# EAGLE design wDuino (EAGLE 6.6.0)
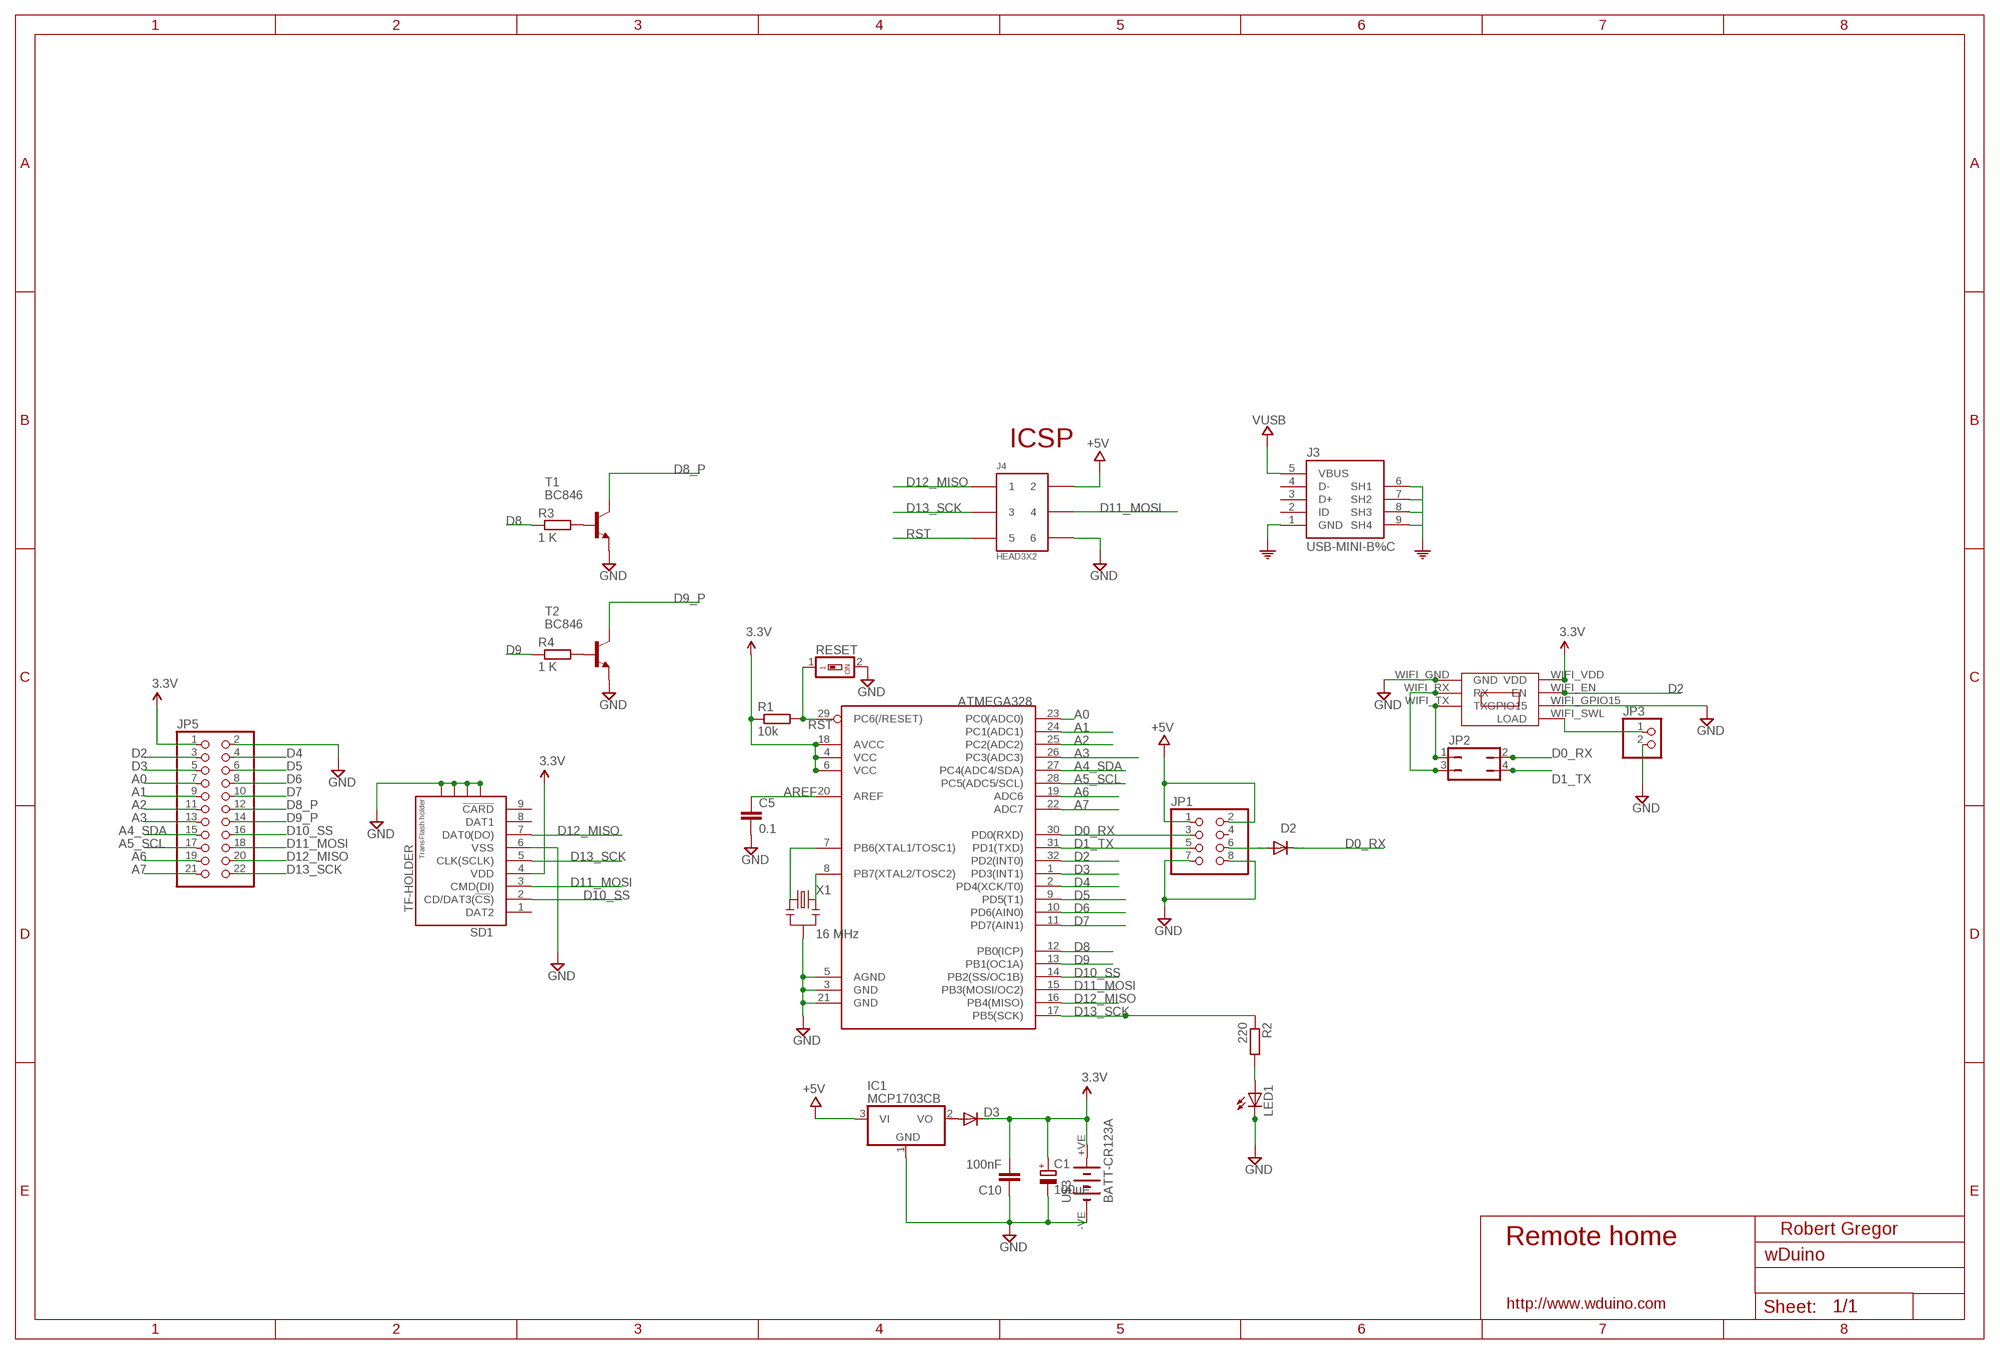
[diagram p0: schematic, sheet 1]

## Parts
ATMEGA328  ATMega-328  ATMEGA168/328TQFP32  [TQFP32-08]
C1  100uF  CPOL-EUSMCB  [SMC_B]
C5  0.1  C-EUC0603  [C0603]
C10  100nF  C-EUC0603  [C0603]
D2  DIODE-SOD123  [SOD123]
D3  DIODE-DO214AC  [DO214AC]
IC1  MCP1703CB  [SOT23]
J3  USB-MINI-B%C  [USB-MINI-B_2]
J4  HEAD3X2  [HEAD3X2]
JP1  PINHD-2X4  [2X04]
JP2  JP2Q  [JP2Q]
JP3  PINHD-1X2  [1X02]
JP5  PINHD-2X11  [2X11]
LED1  LEDSML0603  [SML0603]
R1  10k  R-EU_R0603  [R0603]
R2  220  R-EU_R0603  [R0603]
R3  1 K  R-EU_R0603  [R0603]
R4  1 K  R-EU_R0603  [R0603]
RESET  SWS001  [SMS-001]
SD1  TF-HOLDER  [TF-PULL]
T1  BC846  [SOT23]
T2  BC846  [SOT23]
U$3  BATT-CR123A  [KEYSTONE-2/3A]
U$5  ESP03  [ESP03]
X1  16 MHz  RESONATORSMD  [RESONATOR-SMD]

## Nets
5V: IC1.3(VI) J3.5(VBUS) J4.2 JP1.1 JP1.2 ; supply symbol labelled +5V, VUSB
A0: ATMEGA328.23(PC0(ADC0)) JP5.7
A1: ATMEGA328.24(PC1(ADC1)) JP5.9
A2: ATMEGA328.25(PC2(ADC2)) JP5.11
A3: ATMEGA328.26(PC3(ADC3)) JP5.13
A4_SDA: ATMEGA328.27(PC4(ADC4/SDA)) JP5.15
A5_SCL: ATMEGA328.28(PC5(ADC5/SCL)) JP5.17
A6: ATMEGA328.19(ADC6) JP5.19
A7: ATMEGA328.22(ADC7) JP5.21
AREF: ATMEGA328.20(AREF) C5.1
D0_RX: ATMEGA328.30(PD0(RXD)) D2.C JP1.3 JP2.2
D1_TX: ATMEGA328.31(PD1(TXD)) JP1.5 JP2.4
D2: ATMEGA328.32(PD2(INT0)) JP5.3 U$5.WIFI_EN(EN)
D3: ATMEGA328.1(PD3(INT1)) JP5.5
D4: ATMEGA328.2(PD4(XCK/T0)) JP5.4
D5: ATMEGA328.9(PD5(T1)) JP5.6
D6: ATMEGA328.10(PD6(AIN0)) JP5.8
D7: ATMEGA328.11(PD7(AIN1)) JP5.10
D8: ATMEGA328.12(PB0(ICP)) R3.1
D8_P: JP5.12 T1.3(C)
D9: ATMEGA328.13(PB1(OC1A)) R4.1
D9_P: JP5.14 T2.3(C)
D10_SS: ATMEGA328.14(PB2(SS/OC1B)) JP5.16 SD1.2(CD/DAT3(!CS!))
D11_MOSI: ATMEGA328.15(PB3(MOSI/OC2)) J4.4 JP5.18 SD1.3(CMD(DI))
D12_MISO: ATMEGA328.16(PB4(MISO)) J4.1 JP5.20 SD1.7(DAT0(DO))
D13_SCK: ATMEGA328.17(PB5(SCK)) J4.3 JP5.22 R2.1 SD1.5(CLK(SCLK))
GND: ATMEGA328.3(GND) ATMEGA328.5(AGND) ATMEGA328.21(GND) C1.- C5.2 C10.1 IC1.1(GND) J3.1(GND) J3.6(SH1) J3.7(SH2) J3.8(SH3) J3.9(SH4) J4.6 JP1.7 JP1.8 JP3.2 JP5.2 LED1.C RESET.2 SD1.6(VSS) SD1.S1 SD1.S2 SD1.S3 SD1.S4 T1.2(E) T2.2(E) U$3.-VE(-) U$5.WIFI_GND(GND) U$5.WIFI_GPIO15(GPIO15) X1.2 ; supply symbol labelled COM
N$1: ATMEGA328.7(PB6(XTAL1/TOSC1)) X1.1
N$2: D3.A IC1.2(VO)
N$4: LED1.A R2.2
N$5: JP3.1 U$5.WIFI_SWL(LOAD)
N$6: R4.2 T2.1(B)
N$7: D2.A JP1.6
N$8: R3.2 T1.1(B)
N$10: JP2.1 U$5.WIFI_TX(TX)
N$11: JP2.3 U$5.WIFI_RX(RX)
N$21: ATMEGA328.8(PB7(XTAL2/TOSC2)) X1.3
RST: ATMEGA328.29(PC6(/RESET)) J4.5 R1.2 RESET.1
VCC: ATMEGA328.4(VCC) ATMEGA328.6(VCC) ATMEGA328.18(AVCC) C1.+ C10.2 D3.C JP5.1 R1.1 SD1.4(VDD) U$3.+VE(+) U$5.WIFI_VDD(VDD) ; supply symbol labelled 3.3V
Unconnected: J3.2(ID) J3.3(D+) J3.4(D-) JP1.4 SD1.1(DAT2) SD1.8(DAT1) SD1.9(!CARD)

## Notes on the sheet
- ICSP
- Robert Gregor
- Remote home
- http://www.wduino.com

## Library data of the parts
ATMEGA328 = LowPowerLab:ATMEGA168/328: Atmel 32-pin 8-bit micro, 16k flash.
C1 = resistor:CPOL-EU: POLARIZED CAPACITOR, European symbol
C5 C10 = resistor:C-EU: CAPACITOR, European symbol
D2 D3 = diode:DIODE-: DIODE
IC1 = mcp1703:MCP1703: 250 mA, 16V, Low Quiescent Current LDO Regulator Source: http://ww1.microchip.com/downloads/en/DeviceDoc/22049b.pdf
J3 = MyCON2:USB-MINI-B
J4 = MyCON2:HEAD3X2
JP1 = pinhead:PINHD-2X4: PIN HEADER
JP2 = jumper:JP2Q: JUMPER
JP3 = pinhead:PINHD-1X2: PIN HEADER
JP5 = pinhead:PINHD-2X11: PIN HEADER
LED1 = led:LED: LED OSRAM: - CHIPLED LG R971, LG N971, LY N971, LG Q971, LY Q971, LO R971, LY R971 LH N974, LH R974 LS Q976, LO Q976, LY Q976 LO Q996 - Hyper CHIPLED LW Q18S LB Q993, LB Q99A, LB R99A - SideLED LS A670, LO A670, LY A670, LG A670, LP A670 LB A673, LV A673, LT A673, LW A673 LH A674 LY A675 LS A676, LA A676, LO A676, LY A676, LW A676 LS A679, LY A679, LG A679 - Hyper Micro SIDELED® LS Y876, LA Y876, LO Y876, LY Y876 LT Y87S - SmartLED LW L88C, LW L88S LB L89C, LB L89S, LG L890 LS L89K, LO L89K, LY L89K LS L896, LA L896, LO L896, LY L896 - TOPLED LS T670, LO T670, LY T670, LG T670, LP T670 LSG T670, LSP T670, LSY T670, LOP T670, LYG T670 LG T671, LOG T671, LSG T671 LB T673, LV T673, LT T673, LW T673 LH T674 LS T676, LA T676, LO T676, LY T676, LB T676, LH T676, LSB T676, LW T676 LB T67C, LV T67C, LT T67C, LS T67K, LO T67K, LY T67K, LW E67C LS E67B, LA E67B, LO E67B, LY E67B, LB E67C, LV E67C, LT E67C LW T67C LS T679, LY T679, LG T679 LS T770, LO T770, LY T770, LG T770, LP T770 LB T773, LV T773, LT T773, LW T773 LH T774 LS E675, LA E675, LY E675, LS T675 LS T776, LA T776, LO T776, LY T776, LB T776 LHGB T686 LT T68C, LB T68C - Hyper Mini TOPLED® LB M676 - Mini TOPLED Santana® LG M470 LS M47K, LO M47K, LY M47K Source: http://www.osram.convergy.de LUXEON: - LUMILED® LXK2-PW12-R00, LXK2-PW12-S00, LXK2-PW14-U00, LXK2-PW14-V00 LXK2-PM12-R00, LXK2-PM12-S00, LXK2-PM14-U00 LXK2-PE12-Q00, LXK2-PE12-R00, LXK2-PE12-S00, LXK2-PE14-T00, LXK2-PE14-U00 LXK2-PB12-K00, LXK2-PB12-L00, LXK2-PB12-M00, LXK2-PB14-N00, LXK2-PB14-P00, LXK2-PB14-Q00 LXK2-PR12-L00, LXK2-PR12-M00, LXK2-PR14-Q00, LXK2-PR14-R00 LXK2-PD12-Q00, LXK2-PD12-R00, LXK2-PD12-S00 LXK2-PH12-R00, LXK2-PH12-S00 LXK2-PL12-P00, LXK2-PL12-Q00, LXK2-PL12-R00 Source: www.luxeon.com KINGBRIGHT: KA-3528ASYC Source: www.kingbright.com
R1-R4 = resistor:R-EU_: RESISTOR, European symbol
RESET = smd-special:SWS001: SMD Dip Switch 1 pol.
SD1 = sd-mmc:TF-HOLDER: TF / Micro SD socket is PUSH-PUSH type, the card can be pushed into and auto locked and pushed out by simply press the card. Surface Mounting type.
T1 T2 = transistor:BC846: NPN TRANSISTOR
U$3 = eagle-library-edeca.net-v5:BATT-CR123A: CR123A (2/3rd AA) battery holder Manufacturer: Keystone Mouser part: 534-1019
U$5 = RemoteHome:ESP03
X1 = SparkFun:RESONATOR: Resonator Small SMD resonator. This is the itty bitty 10/20MHz resonators with built in caps. CSTCE10M0G55 and CSTCE20M0V53. Footprint has been reviewed closely but hasn't been tested yet.

## Net classes
1 power: width 0.381 mm, clearance 0.254 mm

## Board
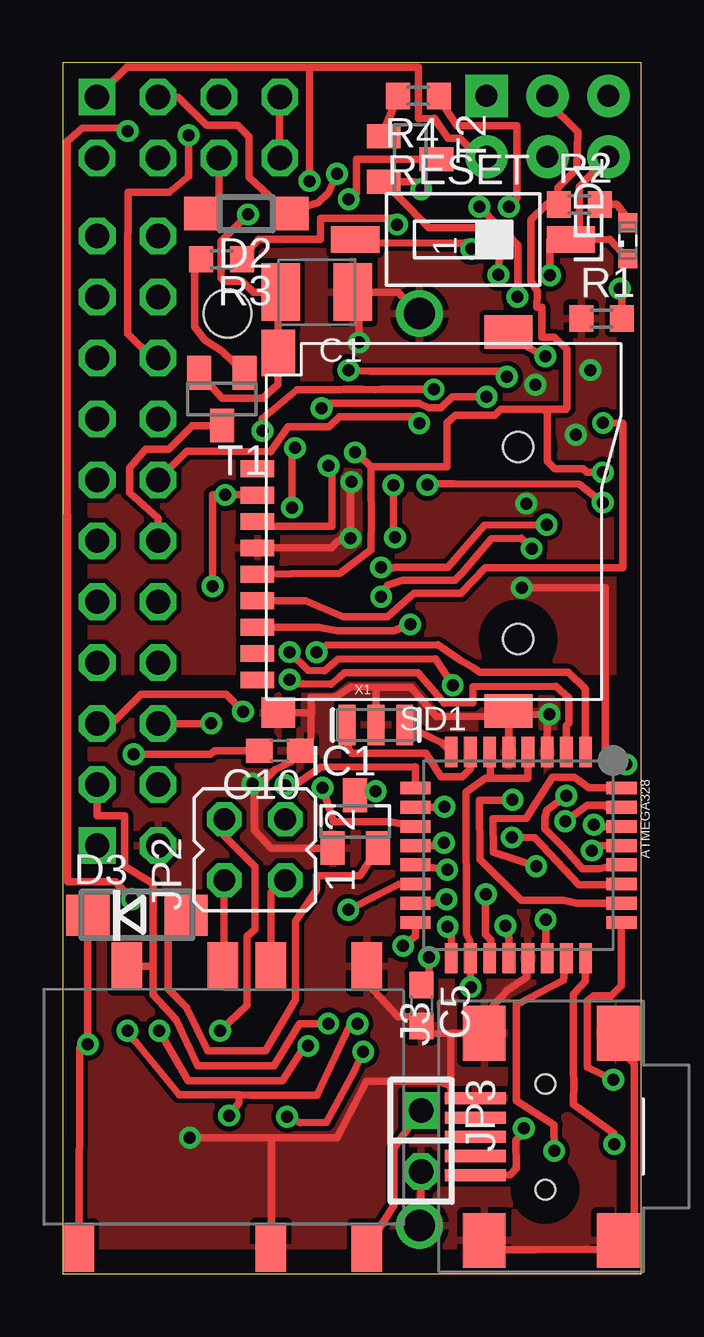
[diagram p1: board, top side]
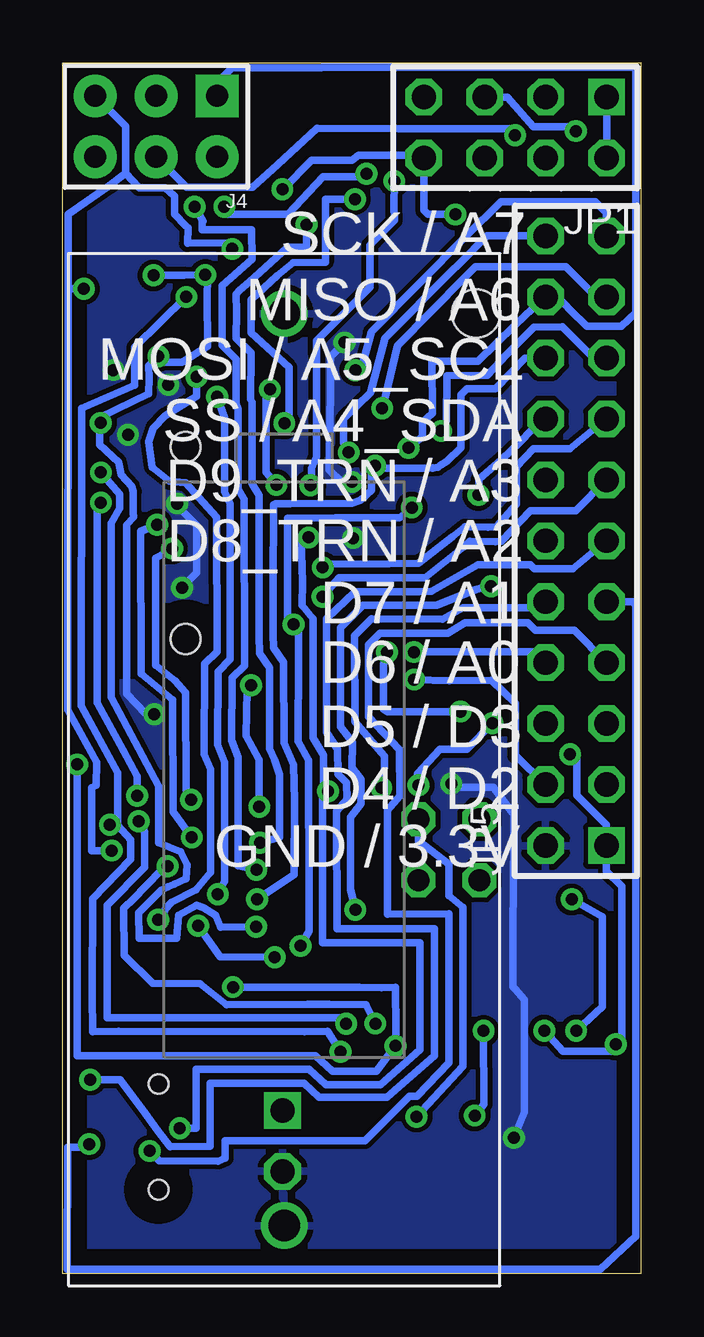
[diagram p2: board, bottom side, seen from below]

Size 24.11 x 50.47 mm. Coordinates in mm from the lower left corner, seen from the top.
Outline: 0,0 24.11,0 24.11,50.47 0,50.47 0,0
Copper layers (1*16): Top 0.035mm / dielectric 1.5mm / Bottom 0.035mm
Design rules "default": minimum track width 10mil, minimum drill 24mil, track to track 8mil, track to pad 8mil, pad to pad 8mil, via to via 8mil, smd to smd 8mil, copper to edge 40mil, drill to drill 8mil, minimum pad ring 10mil, minimum via ring 8mil, stop-mask expansion 4mil, vias tented up to drill 0mil, thermal gap 10mil

### Footprints (pad centres in the part's own frame; a part is rotated, then mirrored left to right if it is on the bottom)
TQFP32-08 = smd 1.27 x 0.533: 1 -4.293,2.8; 2 -4.293,2; 3 -4.293,1.2; 4 -4.293,0.4; 5 -4.293,-0.4; 6 -4.293,-1.2; 7 -4.293,-2; 8 -4.293,-2.8; 17 4.293,-2.8; 18 4.293,-2; 19 4.293,-1.2; 20 4.293,-0.4; 21 4.293,0.4; 22 4.293,1.2; 23 4.293,2; 24 4.293,2.8 | smd 0.533 x 1.27: 9 -2.8,-4.293; 10 -2,-4.293; 11 -1.2,-4.293; 12 -0.4,-4.293; 13 0.4,-4.293; 14 1.2,-4.293; 15 2,-4.293; 16 2.8,-4.293; 25 2.8,4.293; 26 2,4.293; 27 1.2,4.293; 28 0.4,4.293; 29 -0.4,4.293; 30 -1.2,4.293; 31 -2,4.293; 32 -2.8,4.293
SMC_B = smd 1.6 x 2.4: + -1.5,0; - 1.5,0
C0603 = smd 1.1 x 1: 1 -0.85,0; 2 0.85,0
SOD123 = smd 1.4 x 1.4: A 1.9,0; C -1.9,0
DO214AC = smd 1.8 x 1.7: A 2.05,0; C -2.05,0
SOT23 = smd 1 x 1.4: 1 -0.95,-1.1; 2 0.95,-1.1; 3 0,1.1
USB-MINI-B_2 = smd 0.508 x 2.54: 1 0,0; 2 0.8,0; 3 1.6,0; 4 2.4,0; 5 3.2,0 | smd 2.286 x 1.778: 6 -2.717,5.948; 7 -2.717,0.36; 8 5.918,0.36; 9 5.918,5.948 | hole 0.813: -0.6,2.9; 3.8,2.9
HEAD3X2 = drill 0.914 pad 1.778 square: 1 0,0 | drill 0.914 pad 1.778: 2 0,2.54; 3 2.54,0; 4 2.54,2.54; 5 5.08,0; 6 5.08,2.54
2X04 = drill 1.016 square: 1 -3.81,-1.27 | drill 1.016 octagon: 2 -3.81,1.27; 3 -1.27,-1.27; 4 -1.27,1.27; 5 1.27,-1.27; 6 1.27,1.27; 7 3.81,-1.27; 8 3.81,1.27
JP2Q = drill 0.914 octagon: 1 -1.27,-1.27; 2 1.27,-1.27; 3 -1.27,1.27; 4 1.27,1.27
1X02 = drill 1.016 square: 1 -1.27,0 | drill 1.016 octagon: 2 1.27,0
2X11 = drill 1.016 square: 1 -12.7,-1.27 | drill 1.016 octagon: 2 -12.7,1.27; 3 -10.16,-1.27; 4 -10.16,1.27; 5 -7.62,-1.27; 6 -7.62,1.27; 7 -5.08,-1.27; 8 -5.08,1.27; 9 -2.54,-1.27; 10 -2.54,1.27; 11 0,-1.27; 12 0,1.27; 13 2.54,-1.27; 14 2.54,1.27; 15 5.08,-1.27; 16 5.08,1.27; 17 7.62,-1.27; 18 7.62,1.27; 19 10.16,-1.27; 20 10.16,1.27; 21 12.7,-1.27; 22 12.7,1.27
SML0603 = smd 0.8 x 0.8: A 0.75,0; C -0.75,0
R0603 = smd 1 x 1.1: 1 -0.85,0; 2 0.85,0
SMS-001 = smd 1.092 x 2.007: 1 0,-4.496; 2 0,4.496
TF-PULL = smd 0.7 x 1.4: 1 -2.2,-7.62; 2 -1.1,-7.62; 3 0,-7.62; 4 1.1,-7.62; 5 2.2,-7.62; 6 3.3,-7.62; 7 4.4,-7.62; 8 5.5,-7.62; 9 6.6,-7.62 | smd 1.4 x 2: S1 -7.9,2.85; S2 7.9,2.85 | smd 1.28 x 1.4: S3 7.96,-6.75 | smd 1.95 x 1.4: S4 -7.025,-6.75 | hole 1.25: -3.1,3.25; 4.9,3.25
KEYSTONE-2/3A = drill 1.3: +VE 0,19; -VE 0,-19 | hole 2: 8,19
ESP03 = smd 1.27 x 2: WIFI_EN 3.27,-6; WIFI_GND -6.73,-6; WIFI_GPIO15 -2.73,5.73; WIFI_RX -0.73,-6; WIFI_SWL -6.73,5.73; WIFI_TX -2.73,-6; WIFI_VDD 5.27,5.73
RESONATOR-SMD = smd 0.7 x 1.7: 1 -1.2,0; 2 0,0; 3 1.2,0

### Placement (x,y rotation side)
ATMEGA328  18.99,17.44 270 top
C1  10.59,40.9 180 top
C5  14.95,11.18 270 top
C10  9.04,21.8 180 top
D2  7.65,44.17 180 top
D3  3.09,14.94 0 top
IC1  12.19,18.84 0 top
J3  17.21,7.31 270 top
J4  17.67,49.08 180 bottom
JP1  5.23,47.76 180 bottom
JP2  8,17.67 90 top
JP3  14.94,5.54 270 top
JP5  2.7,30.54 90 bottom
LED1  23.55,43.05 90 top
R1  22.46,39.8 0 top
R2  21.53,44.56 0 top
R3  6.61,42.27 180 top
R4  14.82,49.09 180 top
RESET  16.68,43.1 270 top
SD1  15.73,31.35 270 top
T1  6.63,36.45 180 top
T2  14.48,46.45 270 top
U$3  14.87,21.01 0 bottom
U$5  5.95,6.82 180 top
X1  13.05,22.87 0 top

### Tracks (layer width: path | path; a pad name or v marks a point on that pad's centre or on a via)
5V  (via drill 0.5)
  Top 0.305: 17.17,4.07 J3.5 18.67,4.12 18.91,4.39 18.89,5.57 19.2,5.92 v19.22,6.07 | v13.78,32.86 13.78,30.8 v13.85,30.68 | IC1.3 12.92,19.94 v13.04,20.1 | 10.28,50.27 14.34,50.27 14.83,50.27 14.83,48.13 15.48,48.14 16.06,47.31 16.55,47.31 17.32,46.54 J4.2 | 10.28,50.27 2.66,50.27 JP1.1 | v10.28,45.53 10.28,50.22 10.28,50.27
  Bottom 0.305: v13.78,32.86 13.74,33.2 13.73,33.56 13.52,34.04 13.52,37.72 13.52,38.38 13.52,38.87 11.28,41.11 11.28,42.85 11.3,42.87 11.16,43 10.28,43.9 10.29,44.49 v10.28,45.53 | v13.85,30.68 14.12,30.55 14.14,30.07 14.11,28.82 14.12,27.86 13.67,27.3 13.67,22.35 13.23,21.61 13.23,20.22 v13.04,20.1 13.27,19.82 13.26,16.58 13.28,13.8 9.21,13.79 9.2,9.34 10.86,7.88 13.13,7.88 13.84,8.53 18.54,8.52 18.54,6.07 v19.22,6.07 | JP1.2 JP1.1
A0  (via drill 0.5)
  Top 0.305: ATMEGA328.23 20.87,12.23 18.9,11.21 18.9,7.88 18.9,7.2 19.95,6.54 20.47,6.21 v20.48,5.12
  Bottom 0.305: v20.48,5.12 20.08,4.71 17.63,4.7 17.33,4.82 17.34,5.55 12.81,5.55 11.49,5.55 9.64,7.4 9.32,7.4 8,8.79 8,12.01 8,15 10.57,14.98 10.57,18.19 10.57,19.32 10.04,19.92 10.05,21.84 11.36,23.21 11.36,26.22 10.88,26.7 8.03,26.69 7.33,27.12 6.19,27.12 4.7,27.12 4.39,26.81 2.77,26.81 JP5.7
A1  (via drill 0.5)
  Top 0.305: ATMEGA328.24 21.79,12.2 21.29,11.65 21.29,8.41 21.3,8.08 21.29,7.07 22.98,5.87 v23,5.41
  Bottom 0.305: v23,5.41 23.14,5.27 23.91,5.27 23.91,0.19 21.32,0.2 20.56,0.18 1.68,0.19 0.2,1.57 0.2,27.86 0.34,28 JP5.9
A2  (via drill 0.5)
  Top 0.305: ATMEGA328.25 23.29,12.01 22.87,11.59 22.14,11.59 21.88,11.39 21.88,8.62 v22.95,8.09
  Bottom 0.305: v22.95,8.09 21.71,8.1 20.66,6.69 20.11,5.94 19.63,5.3 17.96,5.31 17.95,7.94 14.05,7.94 13.41,7.36 10.59,7.35 8.61,9.1 8.6,14.37 12.67,14.38 12.7,19.28 12.38,19.62 12.26,19.78 12.27,20.47 12.63,20.82 12.64,21.87 13.11,22.57 13.1,26.15 13.11,27.29 11.92,28.42 9.24,28.42 8.72,28.44 6.8,29.55 6.48,29.55 5.24,29.55 4.61,29.55 4.44,29.39 2.83,29.39 JP5.11
A3  (via drill 0.5)
  Top 0.305: v13.27,28.21 13.54,28.69 14.16,28.91 16.36,28.91 16.63,29.18 17.87,30.64 19.12,30.64 19.51,30.25 v19.55,30.22 | v18.75,19.75 18.57,19.74 17.37,19.73 17.39,17.28 19.12,15.56 20.87,15.56 21.43,15.44 ATMEGA328.26
  Bottom 0.305: v13.27,28.21 12.57,29 9,29 7.37,30.31 7.12,30.52 6.05,30.51 5.81,30.52 4.6,31.8 2.72,31.8 JP5.13 | v19.55,30.22 20.24,29.83 20.23,25.35 19.41,24.71 18.98,24.22 18.96,20.16 v18.75,19.75
A4_SDA  (via drill 0.5)
  Top 0.305: v13.26,29.43 13.38,29.29 13.84,29.43 15.02,29.44 16.06,29.44 17.58,31.19 v20.17,31.21 | v18.72,18.18 19.67,18.18 21.51,16.21 23.25,16.21 ATMEGA328.27
  Bottom 0.305: v13.26,29.43 v13.26,29.44 13.12,29.57 10.51,29.59 9.28,29.6 7.85,30.72 7.33,31.13 6.37,31.11 6.03,31.13 5.18,32.06 5.19,33.62 4.47,34.38 2.95,34.37 JP5.15 | v20.17,31.21 20.85,30.93 20.84,25.01 19.53,23.93 19.51,19.26 v18.72,18.18
A5_SCL  (via drill 0.5)
  Top 0.305: ATMEGA328.28 22.66,16.93 22.36,16.87 21.66,16.87 21.26,17.33 20.83,17.82 20.11,18.55 20.09,19 20.18,19.31 v21,19.92 | v8.32,35.12 8.31,35.64 9.77,36.85 11.59,36.85 11.72,36.85 12.5,36.86 13.01,36.84 13.26,36.86 v15.47,36.85 | v22.51,32.14 21.53,32.9 16.3,32.92 15.74,32.91 15.32,32.92 v15.2,32.87
  Bottom 0.305: v21,19.92 21,20.74 21.59,21.82 22.66,23.8 22.67,31.94 22.63,32.1 v22.51,32.14 | v8.32,35.12 8.1,35.54 8.08,37.43 6.39,37.45 5.58,38.32 5.54,38.36 4.46,39.45 3.28,39.45 1.99,38.16 JP5.17 | v15.47,36.85 v15.47,36.84 15.62,36.69 15.62,33.41 v15.2,32.87
A6  (via drill 0.5)
  Top 0.305: v10.79,36.06 11.1,36.27 14.84,36.27 15.25,36.09 15.77,36.1 16.23,36.54 16.95,36.54 v17.67,36.54 | ATMEGA328.19 17.85,13.21 17.85,13.91 17.61,14.15 17.61,15.79 v17.64,15.82
  Bottom 0.305: v10.79,36.06 10.65,36.58 10.14,38.67 7.33,41.52 6.89,41.96 3.12,41.96 1.87,40.7 JP5.19 | v17.67,36.54 17.36,35.67 17.35,32.58 17.14,32.09 17.12,25.61 17.62,25.09 17.65,22.04 17.35,21.32 17.35,21.1 17.35,20.53 17.36,16.35 v17.64,15.82
A7  (via drill 0.5)
  Top 0.305: v11.91,37.65 12.85,37.6 18.23,37.6 18.51,37.48 v18.52,37.38 | v20.13,14.75 20.14,13.2 ATMEGA328.22
  Bottom 0.305: v11.91,37.65 11.65,37.75 11.23,39.25 7.3,43.23 5.83,44.67 1.9,44.67 1.43,44.22 JP5.21 | v18.52,37.38 18.52,36.58 19.83,35.76 20.33,35.22 20.52,34.66 20.37,33.61 19.65,33.02 18.98,32.96 17.69,31.52 17.67,25.92 18.18,25.42 18.2,21.65 17.94,21.03 17.94,16.74 18.55,16.01 19.57,15.48 19.84,15.19 19.95,14.88 v20.13,14.75
AREF  (via drill 0.5)
  Top 0.305: C5.1 15.26,12.45 v15.26,13.19 | v18.45,14.5 18.48,14.44 18.6,13.99 ATMEGA328.20
  Bottom 0.305: v15.26,13.19 17.55,13.21 v18.45,14.5
D0_RX  (via drill 0.5)
  Top 0.305: v18.95,40.71 18.97,40.77 18.97,42.87 18.5,43.35 18.19,43.64 v17.37,44.46 | v22.14,18.71 22.26,18.73 22.6,18.62 23.27,18.62 ATMEGA328.30 | v12.52,9.25 12.14,8.42 11,6.31 9.88,6.3 v9.35,6.55 | JP1.3 4.82,49.03 6,47.85 7.29,47.85 7.75,47.38 7.75,45.69 9.38,44.18 D2.C 10.08,44.46 10.63,44.63 11.07,45.05 v11.43,45.84
  Bottom 0.305: v18.95,40.71 21.1,38.6 21.11,37.03 23.31,36.07 23.33,23.68 21.81,20.87 21.81,18.7 | 21.81,18.7 v22.14,18.71 | 21.81,18.7 21.27,18.08 21.27,17.27 22.86,15.64 22.86,11.62 22.85,10.08 21.77,10.11 14.03,10.1 13.06,10.1 12.67,9.48 v12.52,9.25 | JP2.2 9.27,18.04 8.01,17.07 8.01,15.75 7.42,15.27 7.42,8.66 v9.35,6.55 | v17.37,44.46 17.34,44.4 17.25,44.16 14.71,44.16 13.25,45.7 11.55,45.7 v11.43,45.84
D1_TX  (via drill 0.5)
  Top 0.305: ATMEGA328.31 22.69,19.45 22.59,19.53 21.86,19.53 v20.94,18.86 | v12.28,10.43 11.98,10.39 10.61,7.45 7.81,7.45 7.36,7.47 | 7.36,7.47 4.84,7.46 3.06,9.65 2.71,9.98 v2.69,10.13 | v2.88,15.6 2.55,15.94 2.19,16.33 0.2,16.34 0.18,47.03 0.18,47.2 0.8,47.74 2.55,47.76 v2.71,47.61 | JP2.4 6.73,18.25 8.02,16.97 8.02,14.36 7.68,14.07 7.68,11.2 v6.55,10.12 | v6.92,6.6 7.35,7.13 7.36,7.47
  Bottom 0.305: v20.94,18.86 20.82,18.69 20.7,18.43 20.7,16.95 22.26,15.36 22.26,12.03 22.24,10.68 13.93,10.68 13.5,10.67 12.57,10.67 v12.28,10.43 | v2.69,10.13 1.59,11.13 1.59,11.42 1.59,14.88 v2.88,15.6 | v6.55,10.12 6.53,7.07 v6.92,6.6 | v2.71,47.61 2.96,47.79 4.48,47.8 5.55,49.03 6.46,49.03 JP1.5
D2  (via drill 0.5)
  Top 0.305: ATMEGA328.32 21.93,20.25 21.33,20.7 20.42,20.69 19.59,19.42 19.33,18.98 17.94,18.96 17.95,17.57 v19.73,16.98 | 2.71,13.16 U$5.WIFI_EN 3.76,12.82 | 3.76,12.82 3.76,16.26 2.58,16.99 2.58,18.6 2.58,19.08 1.42,19.08 JP5.3 | 3.76,12.82 3.75,12.69 3.76,11.64 4.72,10.58 5.61,8.68 8.81,8.68 9.7,10.14 9.86,10.42 v11.07,10.43
  Bottom 0.305: v19.73,16.98 19.95,16.87 20.65,16.15 21.15,15.64 21.57,15.24 21.55,13.28 20.35,12.1 18.36,12.1 17.28,11.22 13.9,11.22 13,11.22 11.46,11.21 v11.07,10.43
D3  (via drill 0.5)
  Top 0.305: ATMEGA328.1 21.79,24.37 21.07,25.06 17.39,25.06 17.11,25.25 16.57,25.57 15.63,26.21 11,26.2 10.56,25.83 v10.58,25.9 | JP5.5 2.03,22.92 3.26,24.15 6.79,24.15 v7.52,23.43
  Bottom 0.305: v7.52,23.43 10.56,23.41 10.72,23.52 10.74,25.39 v10.58,25.9
D4  (via drill 0.5)
  Top 0.305: v9.45,24.76 9.65,24.57 10.02,24.58 11.18,24.57 11.54,24.86 11.75,25.05 14.81,25.04 15.9,23.77 17.1,23.79 17.09,24 17.09,24.47 20.56,24.48 21.09,24 21.09,22.93 20.98,22.83 ATMEGA328.2
  Bottom 0.305: v9.45,24.76 7.98,24.72 6.22,24.73 5.22,23.78 5.22,21.6 JP5.4
D5  (via drill 0.5)
  Top 0.305: ATMEGA328.9 14.71,20.24 14.71,21.13 10.73,21.11 9.65,20.36 v9.27,20.36 | JP5.6 6.17,22.92 v6.19,22.94
  Bottom 0.305: v6.19,22.94 7.24,21.85 8.37,21.87 9.31,20.85 9.31,20.39 v9.27,20.36
D6  (via drill 0.5)
  Top 0.305: ATMEGA328.10 15.89,19.44 v15.91,19.46 | v16.25,24.52 15.54,25.62 11.48,25.61 10.92,25.12 10.22,25.15 v9.46,25.91
  Bottom 0.305: v15.91,19.46 15.91,21.42 16.45,22.42 16.42,24.35 v16.25,24.52 | v9.46,25.91 9.26,25.92 4.42,25.92 JP5.8
D7  (via drill 0.5)
  Top 0.305: ATMEGA328.11 13.63,18.84 11.48,18.83 11.29,18.85 v10.82,20.26
  Bottom 0.305: v10.82,20.26 10.7,20.5 10.69,21.56 11.92,23 11.93,26.59 11.23,27.3 8.27,27.28 7.42,27.75 4.22,27.75 JP5.10
D8  (via drill 0.5)
  Top 0.305: ATMEGA328.12 15.7,17.84 v15.88,17.96 | v13.94,43.72 13.93,43.77 13.93,43.98 10.74,43.98 10.74,43.1 9.24,43.11 8.16,43.1 R3.1
  Bottom 0.305: v15.88,17.96 15.06,18.18 15.07,20.79 15.27,21.42 15.47,21.87 15.48,25.25 15.9,25.86 15.92,26.57 15.92,32.44 16.21,32.91 16.21,36.31 16.27,36.45 16.26,38.38 16.87,38.99 16.86,40.09 16.88,40.82 16.73,40.98 16.31,41.35 15.66,41.91 14.74,42.77 13.94,42.77 v13.94,43.72
D8_P
  Top 0.305: T1.3 5.38,35.35 4.41,34.36 3.44,34.36 2.79,33.59 2.77,32.54 3.97,31.48 JP5.12
D9  (via drill 0.5)
  Top 0.305: v16.03,16.84 15.43,16.92 14.72,17.02 ATMEGA328.13 | R4.1 15.66,49 16.43,47.83 18.92,47.83 18.93,47.51 18.93,44.81 v18.6,44.46
  Bottom 0.305: v18.6,44.46 18.25,43.86 18.28,43.86 18.28,43.51 16.23,43.5 16.22,42.27 17.45,41.17 17.45,39.24 17.46,38.69 16.87,38.11 16.87,36.26 16.79,36.02 16.79,32.72 16.54,32.27 16.52,25.34 17.04,24.84 17.05,22.24 16.8,21.53 16.79,20.03 16.79,17 v16.03,16.84
D9_P  (via drill 0.5)
  Top 0.305: v14.86,35.44 14.58,35.71 11.53,35.71 11.1,35.3 10.98,35.3 9.39,35.29 8.66,34.26 7.26,34.27 5.15,34.27 JP5.14 | T2.3 12.23,46.45 12.24,45.37 12.24,45.02 v11.92,44.78
  Bottom 0.305: v14.86,35.44 14.87,35.46 14.67,35.66 14.67,37.77 16.25,39.22 16.26,39.56 16.26,40.6 15.16,41.58 14.5,42.14 13.15,42.15 13.14,44.78 v11.92,44.78
D10_SS  (via drill 0.5)
  Top 0.305: ATMEGA328.14 14.01,16.23 12.93,15.68 12.24,15.33 v11.9,15.17 | SD1.2 7.92,32.45 7.86,32.45 v6.77,32.46 6.24,32.47 v6.24,28.65
  Bottom 0.305: v11.9,15.17 12.11,16.03 12.1,19.04 11.66,19.58 11.67,20.6 12.04,21.09 12.03,22.16 12.52,22.79 12.51,25.25 12.51,26.92 11.59,27.87 8.53,27.87 6.9,28.5 6.33,28.67 v6.24,28.65 | v6.77,32.46 6.74,33.11 5.79,33.95 5.05,34.64 4.54,35.17 JP5.16
D11_MOSI  (via drill 0.5)
  Top 0.305: ATMEGA328.15 15.42,15.44 v16,15.61 | SD1.3 8.83,31.15 9.39,31.14 11.22,31.14 11.22,32.12 11.22,32.68 11.22,33.44 v11.07,33.67 | JP5.18 3.71,38.16 2.71,39.17 2.71,41.68 2.72,45.07 4.43,45.08 5.24,45.74 v5.24,47.45
  Bottom 0.305: v16,15.61 14.45,16.64 14.45,19.7 14.48,21.21 14.88,22.14 14.89,25.49 15.31,26.08 15.32,26.65 15.33,28.58 15.32,32.05 15.23,32.09 14.63,32.08 12.04,32.1 11.7,32.24 11.24,32.65 11.24,33.38 v11.07,33.67 10.74,33.67 10.65,33.58 8.86,33.58 8.66,33.59 8.69,33.57 8.47,33.6 8.35,33.69 8.09,33.86 7.49,34.43 7.49,36.62 7.25,36.87 6.07,36.88 4.83,38.16 JP5.18 | v5.24,47.45 5.49,47.72 10.1,47.72 13.47,47.72 13.5,47.72 15.15,46.21 16.18,45.28 18.95,45.28 J4.4
D12_MISO  (via drill 0.5)
  Top 0.305: ATMEGA328.16 14.7,14.06 v14.19,13.66 | SD1.7 10.63,26.95 11.45,26.8 13.81,26.8 v14.48,27.06 | v9.69,34.41 9.55,34.06 v9.55,31.93
  Bottom 0.305: v14.19,13.66 13.84,14.28 13.83,15.71 13.86,21.4 14.28,22.19 14.28,25.68 14.28,26.85 v14.48,27.06 14.74,27.31 14.74,27.77 14.73,28.82 14.74,31.49 13.87,31.49 12.73,31.51 11.25,31.51 10.06,31.51 v9.55,31.93 | v9.69,34.41 9.11,34.88 9.11,35.49 8.68,35.85 8.7,38.02 6.8,38.03 5.27,39.51 4.84,39.91 JP5.20 3.46,40.7 2.93,40.15 2.25,39.49 0.81,39.48 0.21,40.05 0.2,42.73 0.21,50.08 0.19,50.27 13.29,50.27 13.3,50.26 17.03,50.26 17.67,49.63 J4.1
D13_SCK  (via drill 0.5)
  Top 0.305: v12.18,34.23 12.67,33.79 12.86,33.62 | SD1.5 9.54,29.17 11.55,29.19 12.85,30.16 12.86,31.62 12.86,31.83 12.85,32.5 12.86,33.62 | 20.06,36.02 18.27,36.02 18.01,35.78 16.36,35.78 16.02,35.45 16.02,35.17 16.02,33.62 15.06,33.62 13.34,33.63 12.86,33.62 | 20.06,36.02 20.98,36.02 21.02,36.06 21.02,38.52 20.5,39.02 19.97,39.02 19.97,40.27 19.77,40.27 19.77,40.94 19.52,41.37 19.52,43.92 20.18,44.56 R2.1 20.65,45.26 21.43,46.04 21.46,47.58 20.21,48.84 J4.3 | ATMEGA328.17 16.19,14.27 v16.04,14.46 | v22.52,33.39 21.85,33.39 21.7,33.55 20.52,33.55 20.2,33.86 20.2,35.88 20.06,36.02
  Bottom 0.305: v12.18,34.23 12.39,34.62 12.39,35.62 11.27,36.71 10.67,38.98 7.9,41.78 7.57,42.1 6.42,43.24 JP5.22 | v22.52,33.39 21.72,32.49 21.72,31.9 22.08,31.27 22.07,24.02 20.1,20.32 20.1,18.59 20.1,17.96 19.18,17.58 18.91,17.05 18.96,16.46 19.45,16.23 19.71,16.13 20.01,15.98 20.51,15.47 20.93,15.05 20.92,13.98 19.35,13.98 19.27,14.93 18.52,15.36 18.23,15.26 17.73,14.93 17.53,14.45 v16.04,14.46
GND  (via drill 0.5)
  Top 0.305: v20.32,41.61 20.31,43.09 RESET.2 | U$5.WIFI_GPIO15 8.69,2.82 8.69,3.67 8.69,5.61 8.75,5.67 | 8.75,38.64 8.68,38.34 8.95,38.34 SD1.S4 | U$5.WIFI_GND 12.69,12.08 13.98,10.72 14.03,10.71 14.48,10.71 C5.2 | ATMEGA328.5 18.6,21.73 18.6,23.44 18.88,23.43 | 20.2,23.3 19.39,23.31 19.02,23.38 18.88,23.43 | 20.2,23.3 ATMEGA328.3 | X1.2 13.06,23.39 | 13.06,23.39 13.05,24.44 14.52,24.45 15.58,23.21 18.09,23.23 18.02,23.34 18.61,23.39 18.88,23.43 | 10.36,23.32 10.35,22.89 10.35,22.35 10.05,21.7 C10.1 9.52,21.34 8.84,21 8.27,20.42 v7.9,20.42 7.99,19.87 7.99,18.48 8.69,17.74 IC1.1 | 10.36,23.32 10.36,23.39 10.35,24.02 11.26,24.02 11.52,24.14 12,24.46 13.06,24.45 13.06,23.39 | J3.6 23.16,10.05 23.16,10.06 23.16,9.43 23.84,8.76 23.84,4.64 | J3.9 23.84,2.07 23.84,2.87 | ATMEGA328.21 19.34,12.35 18.53,11.81 17.96,11.17 17.71,10.86 J3.7 16.21,10.02 | 20.2,23.3 20.24,23.35 v20.28,23.32 | C5.2 14.99,10.03 | 16.18,7.8 16.18,7.32 J3.1 | SD1.6 10.12,28.05 11.68,27.38 13.54,27.38 14.63,28.35 16.61,28.35 17.62,29.42 19.61,29.42 23.34,29.43 23.34,35.44 v22.52,35.46 | 23.84,4.64 23.84,2.87 | v5.29,5.67 6.93,5.67 8.75,5.67 | 8.75,5.67 11.43,5.67 12.65,8.02 15.7,8.03 16.18,7.8 | 23.84,5.08 23.84,4.64 | SD1.S3 10.35,23.39 10.36,23.32 | SD1.S1 19.18,38.72 v20.12,38.23 | 16.21,10.02 15.37,10.01 C5.2 | J3.8 17.57,1.35 17.91,1 19.73,1 21.85,1.02 23.84,1.01 23.84,2.87 | T1.2 6.65,36.48 8.32,36.48 8.97,37.06 SD1.S4 | v18.16,41.62 18.18,41.65 18.2,42.73 17.34,43.6 15.27,43.58 14.02,44.87 T2.2 14.63,45.5 v14.95,45.19 | 16.18,7.8 16.18,9.98 16.21,10.02 | JP3.2 14.94,2.59 14.87,2.52 U$3.-VE | JP1.7 JP1.8 | J4.6 22.72,46.54 21.54,45.3 21.54,43.43 RESET.2
  Top 0.305: LED1.C 22.8,43.1 RESET.2 | SD1.S4 8.98,40.8 C1.- 7.95,40.9 7.47,41.36 6.7,41.36 6.6,41.48 6.6,43.02 v7.73,44.14
  Bottom 0.305: 5.29,19.13 6.15,20.28 7.71,20.28 v7.9,20.42 | v20.28,23.32 20.65,23.33 21.44,24.16 21.43,31.19 21.15,31.55 21.16,31.7 21.16,32.6 21.24,32.82 21.66,33.29 21.78,33.82 22.56,34.55 22.57,35.43 | 22.57,35.43 22.55,35.69 20.53,36.68 20.51,37.33 20.52,37.83 v20.12,38.23 19.87,37.98 19.14,37.98 18.07,38.64 18.08,40.73 18.06,41.45 v18.16,41.62 19.05,41.62 19.72,41.62 v20.32,41.61 | 5.29,19.13 5.29,17.72 5.31,16.73 5.33,13.8 5.33,11.95 5.23,11.85 4.86,11.42 4.85,6.74 v5.29,5.67 | v22.52,35.46 22.57,35.43 | 5.28,19.14 5.29,19.13 | v7.73,44.14 8.88,44.14 9.05,44.31 JP1.8 9.15,46.6 11.77,46.61 12.04,46.4 13.72,46.4 14.92,45.19 v14.95,45.19
  pour Bottom: 23.88,24.65 0.18,24.64 0.18,0.18 23.91,0.21 23.91,22.44
  pour Top: 23.9,24.63 0.19,24.65 0.26,0.21 23.9,0.21 23.9,20.37 23.92,22.5
N$1
  Top 0.305: ATMEGA328.7 16.99,21.04 16.67,20.71 15.76,20.71 15.14,21.69 12.03,21.69 11.91,21.87 11.89,22.09 X1.1
N$2
  Top 0.305: IC1.2 12.39,16.59 10.57,16.59 10.57,16 9.71,14.69 9.71,11.43 8.46,9.3 6.04,9.3 5.16,11.08 4.38,11.89 4.38,14.54 D3.A
N$4
  Top 0.305: R2.2 22.84,44.56 23.1,44.56 23.56,43.97 LED1.A
N$5
  Top 0.305: JP3.1 13.81,5.23 13.81,2.85 U$5.WIFI_SWL
N$6
  Top 0.305: R4.2 13.5,47.88 T2.1
N$7
  Top 0.305: JP1.6 6.5,44.68 D2.A
N$8
  Top 0.305: T1.1 6.64,38.45 6.33,38.65 6.25,38.7 5.92,38.93 5.5,39.47 5.5,40.8 5.49,41.68 R3.2
N$10
  Top 0.305: JP2.1 8.68,15.9 U$5.WIFI_TX
N$11
  Top 0.305: 6.88,12.74 U$5.WIFI_RX 6.73,12.88 JP2.3
N$21
  Top 0.305: X1.3 15.81,22.12 ATMEGA328.8
RST  (via drill 0.5)
  Top 0.305: v17.04,42.7 16.75,42.95 16.59,42.94 16.32,42.95 15.65,42.95 12.74,42.96 RESET.1 | ATMEGA328.29 22.27,17.84 v22.06,17.64 | R1.2 23.31,40.86 v23.22,41.04
  Bottom 0.305: v17.04,42.7 17.02,42.7 17.17,42.95 18.9,42.94 18.88,43.58 18.97,43.67 19.45,44.14 19.45,44.9 19.84,45.26 20.92,45.26 21.49,45.86 | v22.06,17.64 22.89,17.64 22.89,20.26 22.7,20.35 22.7,21.32 23.9,23.51 23.87,41.89 | 23.87,41.89 23.87,44.15 22.18,45.35 21.49,45.86 | 21.49,45.86 21.48,47.81 J4.5 | v23.22,41.04 23.87,41.04 23.87,41.89
VCC  (via drill 0.5)
  Top 0.305: v17.01,11.95 16.99,12.68 ATMEGA328.18 16.98,13.86 16.83,14.17 16.81,20.06 17.61,20.66 17.83,20.66 | ATMEGA328.6 17.83,21.74 17.83,20.66 | C10.2 7.47,21.8 6.33,21.8 6.14,21.65 v2.95,21.65 | SD1.4 8.58,30.25 11.2,30.25 11.4,30.49 12,30.84 12,32.54 v12.03,33 | U$5.WIFI_VDD 0.7,9.39 v1.04,9.56 1.04,10.01 D3.C | v23.5,21.23 22.63,21.65 22.63,22.34 22.62,24.87 22.62,28.59 v19.13,28.59 | ATMEGA328.4 19.39,20.64 17.83,20.66 | v10.23,9.5 9.97,9.31 9.16,8.06 5.22,8.06 v4.02,10.13 | U$3.+VE 13.98,40.9 C1.+ 12.35,40.64 v12.35,38.81
  Bottom 0.305: v17.01,11.95 13.9,11.94 11.72,11.94 10.82,11.93 10.22,11.95 10.22,10.19 v10.23,9.5 11.03,8.44 12.28,8.45 12.85,8.45 13.57,9.09 16.01,9.1 23.51,9.1 v23.5,21.23 | v12.03,33 12.48,33 13,33.5 12.99,34.38 12.95,34.91 12.95,37.41 12.95,38.21 v12.35,38.81 | v19.33,32.1 19.33,32 18.52,31.18 18.52,29.2 v19.13,28.59 | v4.02,10.13 3.77,9.87 3.25,9.28 1.24,9.28 v1.04,9.56 0.8,9.81 0.8,16.14 1.43,16.77 JP5.1 1.43,18.7 2.67,19.94 2.67,21.61 v2.95,21.65
  other vias: 11.99,30.66 19.7,37.05 21.99,37.66 21.38,34.97
  pour Bottom: 23.59,25.1 0.19,25.11 0.19,50.29 23.91,50.29 23.91,25.11
  pour Top: 23.62,25.1 0.19,25.11 0.19,50.27 23.91,50.27 23.91,25.11

### Text on the board
bPlace: SS / A4_SDA | D9_TRN / A3 | D8_TRN / A2 | D7 / A1 | D6 / A0 | D5 / D3 | D4 / D2 | GND / 3.3V
bNames: SCK / A7 | MISO / A6 | MOSI / A5_SCL